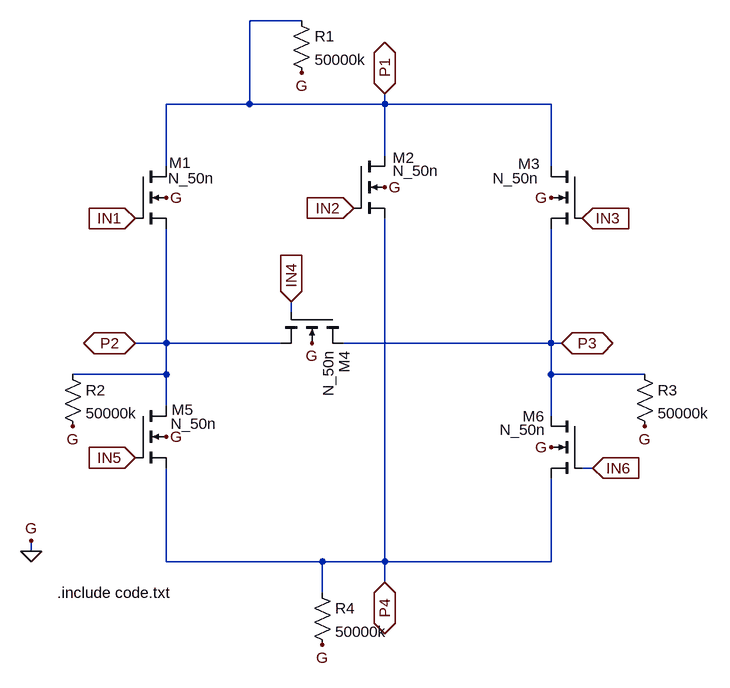
[diagram p0: schematic Circuit2_Part2_SwitchMatrix_Basic.asc]
Circuit2_Part2_SwitchMatrix_Basic.asc, the LTspice schematic file:
Version 4
SHEET 1 880 680
WIRE 16 -368 -64 -368
WIRE -64 -240 -64 -368
WIRE -64 -240 -192 -240
WIRE 144 -240 144 -256
WIRE 144 -240 -64 -240
WIRE 400 -240 144 -240
WIRE 144 -160 144 -240
WIRE -192 -144 -192 -240
WIRE 400 -144 400 -240
WIRE 0 80 0 64
WIRE -192 128 -192 -48
WIRE -192 128 -240 128
WIRE -16 128 -192 128
WIRE 400 128 400 -48
WIRE 400 128 80 128
WIRE 416 128 400 128
WIRE -192 176 -192 128
WIRE -192 176 -336 176
WIRE 400 176 400 128
WIRE 544 176 400 176
WIRE -192 224 -192 176
WIRE 400 240 400 176
WIRE 464 320 448 320
WIRE -400 448 -400 432
WIRE -192 464 -192 320
WIRE 48 464 -192 464
WIRE 144 464 144 -64
WIRE 144 464 48 464
WIRE 400 464 400 336
WIRE 400 464 144 464
WIRE 144 496 144 464
WIRE 48 512 48 464
FLAG -240 -64 IN1
IOPIN -240 -64 In
FLAG -240 304 IN5
IOPIN -240 304 In
FLAG 464 320 IN6
IOPIN 464 320 In
FLAG 448 -64 IN3
IOPIN 448 -64 In
FLAG 96 -80 IN2
IOPIN 96 -80 In
FLAG 0 64 IN4
IOPIN 0 64 In
FLAG 144 -256 P1
IOPIN 144 -256 BiDir
FLAG -240 128 P2
IOPIN -240 128 BiDir
FLAG 144 496 P4
IOPIN 144 496 BiDir
FLAG 416 128 P3
IOPIN 416 128 BiDir
FLAG 400 -96 G
FLAG 144 -112 G
FLAG -192 -96 G
FLAG 32 128 G
FLAG -192 272 G
FLAG 400 288 G
FLAG -400 432 G
FLAG -400 448 0
FLAG -336 256 G
FLAG 544 256 G
FLAG 16 -288 G
FLAG 48 592 G
SYMBOL nmos4 -240 -144 R0
WINDOW 0 52 -6 Left 2
WINDOW 3 51 18 Left 2
SYMATTR InstName M1
SYMATTR Value N_50n
SYMATTR Value2 l=10u w=1u
SYMBOL nmos4 96 -160 R0
WINDOW 0 60 3 Left 2
WINDOW 3 60 23 Left 2
SYMATTR InstName M2
SYMATTR Value N_50n
SYMATTR Value2 l=10u w=1u
SYMBOL nmos4 448 -144 M0
WINDOW 0 65 -4 Left 2
WINDOW 3 67 18 Left 2
SYMATTR InstName M3
SYMATTR Value N_50n
SYMATTR Value2 l=10u w=1u
SYMBOL nmos4 448 240 M0
WINDOW 0 58 0 Left 2
WINDOW 3 56 21 Left 2
SYMATTR InstName M6
SYMATTR Value N_50n
SYMATTR Value2 l=10u w=1u
SYMBOL nmos4 -240 224 R0
WINDOW 0 56 6 Left 2
WINDOW 3 55 28 Left 2
SYMATTR InstName M5
SYMATTR Value N_50n
SYMATTR Value2 l=10u w=1u
SYMBOL nmos4 80 80 R90
WINDOW 0 60 -2 Left 2
WINDOW 3 59 23 Left 2
SYMATTR InstName M4
SYMATTR Value N_50n
SYMATTR Value2 l=10u w=1u
SYMBOL res 0 -384 R0
SYMATTR InstName R1
SYMATTR Value 50000k
SYMBOL res -352 160 R0
SYMATTR InstName R2
SYMATTR Value 50000k
SYMBOL res 528 160 R0
SYMATTR InstName R3
SYMATTR Value 50000k
SYMBOL res 32 496 R0
SYMATTR InstName R4
SYMATTR Value 50000k
TEXT -360 512 Left 2 !.include code.txt

The netlist it stands for:
* Circuit2_Part2_SwitchMatrix_Basic.asc
M1 P1 IN1 P2 0 N_50n l=10u w=1u
M2 P1 IN2 P4 0 N_50n l=10u w=1u
M3 P1 IN3 P3 0 N_50n l=10u w=1u
M6 P3 IN6 P4 0 N_50n l=10u w=1u
M5 P2 IN5 P4 0 N_50n l=10u w=1u
M4 P3 IN4 P2 0 N_50n l=10u w=1u
R1 P1 0 50000k
R2 P2 0 50000k
R3 P3 0 50000k
R4 P4 0 50000k
.model NMOS NMOS
.model PMOS PMOS
.lib standard.mos
.include code.txt
.backanno
.end